# Altium schematic sheet AmplifierDclass_Power.SchDoc
size 594 x 420 mm; DocumentNumber: Введите номер платы + Э3; SheetNumber: номер страницы; Format: A2
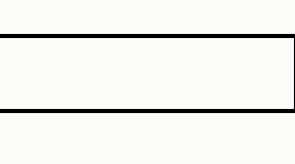
[diagram p0: AmplifierDclass_Power.SchDoc, top left]
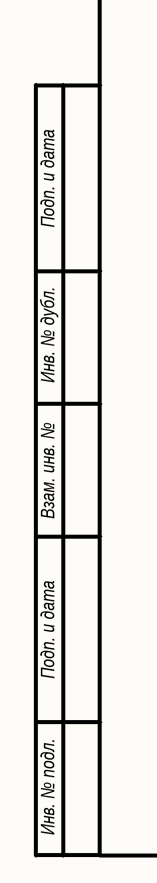
[diagram p1: AmplifierDclass_Power.SchDoc, bottom left]
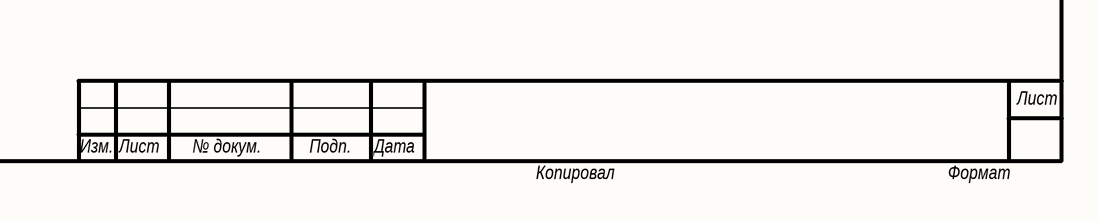
[diagram p2: AmplifierDclass_Power.SchDoc, bottom right]

## Notes on the sheet
- Подп. и дата
- Инв. № дубл.
- Взам. инв. №
- Инв. № подл.
- Лист
- Изм.
- № докум.
- Подп.
- Дата
- Копировал
- Формат